# Altium schematic sheet MainSheet.SchDoc
size A
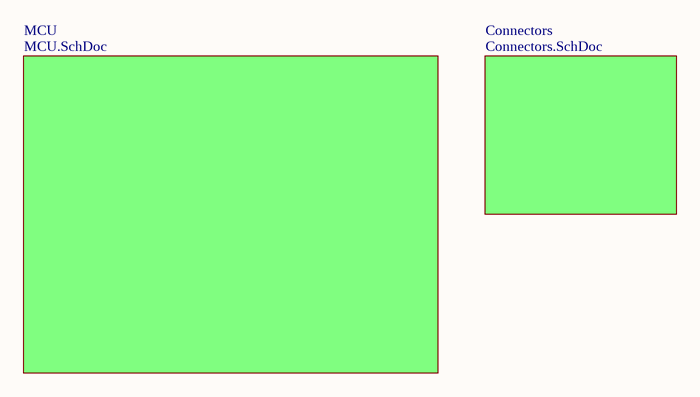
[diagram p0: MainSheet.SchDoc]

## Sub-sheets
Connectors = Connectors.SchDoc: no entries
MCU = MCU.SchDoc: no entries